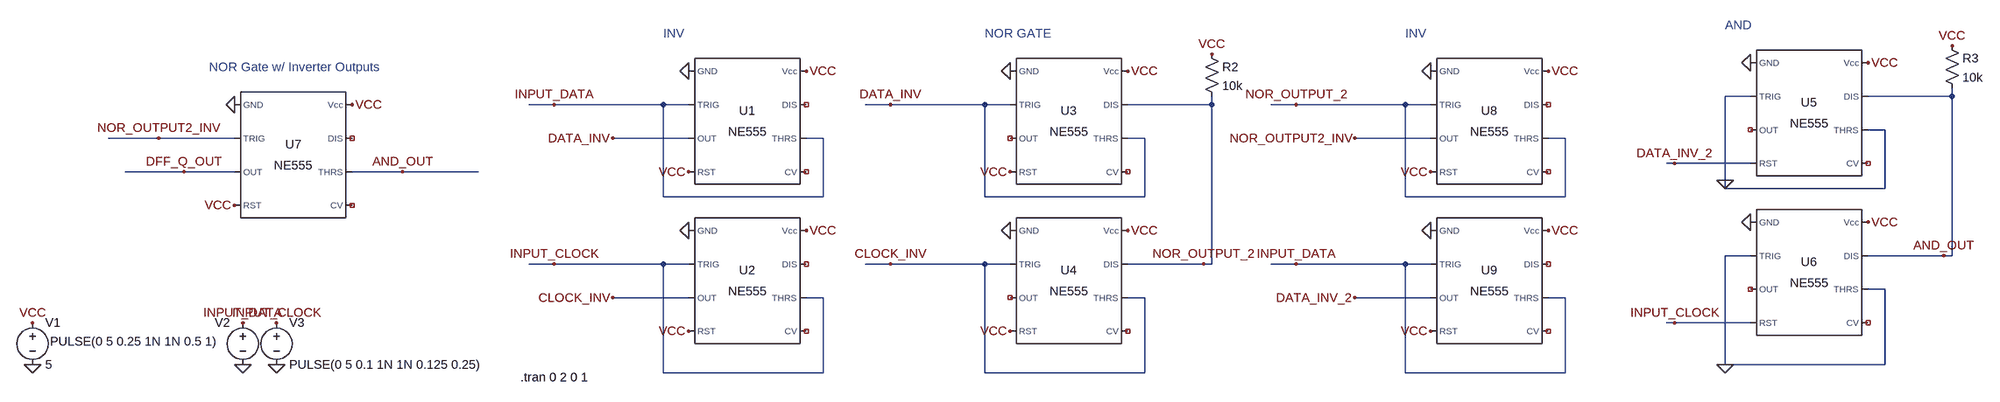
[diagram p0: schematic 555_D_Flip_Flop.asc]
555_D_Flip_Flop.asc, the LTspice schematic file:
Version 4
SHEET 1 2580 680
WIRE 2112 32 2064 32
WIRE 2496 32 2496 16
WIRE 2496 32 2336 32
WIRE -224 48 -272 48
WIRE -16 48 -224 48
WIRE 32 48 -16 48
WIRE 416 48 368 48
WIRE 624 48 416 48
WIRE 672 48 624 48
WIRE 1056 48 1056 32
WIRE 1056 48 896 48
WIRE 1216 48 1168 48
WIRE 1424 48 1216 48
WIRE 1472 48 1424 48
WIRE 2368 96 2336 96
WIRE -976 112 -1072 112
WIRE -832 112 -976 112
WIRE 32 112 -112 112
WIRE 288 112 256 112
WIRE 928 112 896 112
WIRE 1472 112 1328 112
WIRE 1728 112 1696 112
WIRE 1968 160 1952 160
WIRE 2112 160 1968 160
WIRE -928 176 -1040 176
WIRE -832 176 -928 176
WIRE -512 176 -608 176
WIRE -368 176 -512 176
WIRE 2064 192 2064 32
WIRE 2064 208 2064 192
WIRE 2368 208 2368 96
WIRE 2368 208 2064 208
WIRE -16 224 -16 48
WIRE 288 224 288 112
WIRE 288 224 -16 224
WIRE 624 224 624 48
WIRE 928 224 928 112
WIRE 928 224 624 224
WIRE 1424 224 1424 48
WIRE 1728 224 1728 112
WIRE 1728 224 1424 224
WIRE 2112 336 2064 336
WIRE 2480 336 2336 336
WIRE 2496 336 2496 32
WIRE 2496 336 2480 336
WIRE -224 352 -272 352
WIRE -16 352 -224 352
WIRE 32 352 -16 352
WIRE 416 352 368 352
WIRE 624 352 416 352
WIRE 672 352 624 352
WIRE 1040 352 896 352
WIRE 1056 352 1056 48
WIRE 1056 352 1040 352
WIRE 1216 352 1168 352
WIRE 1424 352 1216 352
WIRE 1472 352 1424 352
WIRE 2368 400 2336 400
WIRE 32 416 -112 416
WIRE 288 416 256 416
WIRE 928 416 896 416
WIRE 1472 416 1328 416
WIRE 1728 416 1696 416
WIRE 1968 464 1952 464
WIRE 2112 464 1968 464
WIRE 2064 544 2064 336
WIRE 2368 544 2368 400
WIRE 2368 544 2064 544
WIRE -16 560 -16 352
WIRE 288 560 288 416
WIRE 288 560 -16 560
WIRE 624 560 624 352
WIRE 928 560 928 416
WIRE 928 560 624 560
WIRE 1424 560 1424 352
WIRE 1728 560 1728 416
WIRE 1728 560 1424 560
FLAG -1216 544 0
FLAG -1216 464 VCC
FLAG 32 -16 0
FLAG 256 -16 VCC
FLAG 32 288 0
FLAG 256 288 VCC
FLAG -112 112 DATA_INV
FLAG -112 416 CLOCK_INV
FLAG -224 48 INPUT_DATA
FLAG -224 352 INPUT_CLOCK
FLAG -816 544 0
FLAG -816 464 INPUT_DATA
FLAG -752 544 0
FLAG -752 464 INPUT_CLOCK
FLAG 32 176 VCC
FLAG 32 480 VCC
FLAG 672 -16 0
FLAG 896 -16 VCC
FLAG 672 288 0
FLAG 896 288 VCC
FLAG 416 48 DATA_INV
FLAG 416 352 CLOCK_INV
FLAG 1056 -48 VCC
FLAG 1040 352 NOR_OUTPUT_2
FLAG 672 176 VCC
FLAG 672 480 VCC
FLAG 2112 -32 0
FLAG 2336 -32 VCC
FLAG 2112 272 0
FLAG 2336 272 VCC
FLAG 2496 -64 VCC
FLAG 2480 336 AND_OUT
FLAG -832 48 0
FLAG -608 48 VCC
FLAG -832 240 VCC
FLAG 1472 -16 0
FLAG 1696 -16 VCC
FLAG 1472 288 0
FLAG 1696 288 VCC
FLAG 1328 112 NOR_OUTPUT2_INV
FLAG 1328 416 DATA_INV_2
FLAG 1216 48 NOR_OUTPUT_2
FLAG 1216 352 INPUT_DATA
FLAG 1472 176 VCC
FLAG 1472 480 VCC
FLAG 2064 192 0
FLAG 2064 544 0
FLAG 1968 464 INPUT_CLOCK
FLAG 1968 160 DATA_INV_2
FLAG -512 176 AND_OUT
FLAG -976 112 NOR_OUTPUT2_INV
FLAG -928 176 DFF_Q_OUT
SYMBOL voltage -1216 448 R0
SYMATTR InstName V1
SYMATTR Value 5
SYMBOL Misc\\NE555 144 80 R0
SYMATTR InstName U1
SYMBOL Misc\\NE555 144 384 R0
SYMATTR InstName U2
SYMBOL voltage -816 448 M0
WINDOW 3 49 52 Left 2
WINDOW 123 0 0 Left 0
WINDOW 39 0 0 Left 0
SYMATTR Value PULSE(0 5 0.25 1N 1N 0.5 1)
SYMATTR InstName V2
SYMBOL voltage -752 448 R0
WINDOW 123 0 0 Left 0
WINDOW 39 0 0 Left 0
SYMATTR InstName V3
SYMATTR Value PULSE(0 5 0.1 1N 1N 0.125 0.25)
SYMBOL Misc\\NE555 784 80 R0
SYMATTR InstName U3
SYMBOL Misc\\NE555 784 384 R0
SYMATTR InstName U4
SYMBOL res 1040 -64 R0
SYMATTR InstName R2
SYMATTR Value 10k
SYMBOL Misc\\NE555 2224 64 R0
SYMATTR InstName U5
SYMBOL Misc\\NE555 2224 368 R0
SYMATTR InstName U6
SYMBOL res 2480 -80 R0
SYMATTR InstName R3
SYMATTR Value 10k
SYMBOL Misc\\NE555 -720 144 R0
SYMATTR InstName U7
SYMBOL Misc\\NE555 1584 80 R0
SYMATTR InstName U8
SYMBOL Misc\\NE555 1584 384 R0
SYMATTR InstName U9
TEXT -16 -88 Left 2 ;INV
TEXT -288 568 Left 2 !.tran 0 2 0 1
TEXT 624 -88 Left 2 ;NOR GATE
TEXT 2064 -104 Left 2 ;AND
TEXT -880 -24 Left 2 ;NOR Gate w/ Inverter Outputs
TEXT 1424 -88 Left 2 ;INV

The netlist it stands for:
* 555_D_Flip_Flop.asc
V1 VCC 0 5
XU1 0 INPUT_DATA DATA_INV VCC NC_01 INPUT_DATA NC_02 VCC NE555  ; pins GND TRIG OUT RST CV THRS DIS Vcc
XU2 0 INPUT_CLOCK CLOCK_INV VCC NC_03 INPUT_CLOCK NC_04 VCC NE555  ; pins GND TRIG OUT RST CV THRS DIS Vcc
V2 INPUT_DATA 0 PULSE(0 5 0.25 1N 1N 0.5 1)
V3 INPUT_CLOCK 0 PULSE(0 5 0.1 1N 1N 0.125 0.25)
XU3 0 DATA_INV NC_05 VCC NC_06 DATA_INV NOR_OUTPUT_2 VCC NE555  ; pins GND TRIG OUT RST CV THRS DIS Vcc
XU4 0 CLOCK_INV NC_07 VCC NC_08 CLOCK_INV NOR_OUTPUT_2 VCC NE555  ; pins GND TRIG OUT RST CV THRS DIS Vcc
R2 VCC NOR_OUTPUT_2 10k
XU5 0 0 NC_09 DATA_INV_2 NC_10 0 AND_OUT VCC NE555  ; pins GND TRIG OUT RST CV THRS DIS Vcc
XU6 0 0 NC_11 INPUT_CLOCK NC_12 0 AND_OUT VCC NE555  ; pins GND TRIG OUT RST CV THRS DIS Vcc
R3 VCC AND_OUT 10k
XU7 0 NOR_OUTPUT2_INV DFF_Q_OUT VCC NC_13 AND_OUT NC_14 VCC NE555  ; pins GND TRIG OUT RST CV THRS DIS Vcc
XU8 0 NOR_OUTPUT_2 NOR_OUTPUT2_INV VCC NC_15 NOR_OUTPUT_2 NC_16 VCC NE555  ; pins GND TRIG OUT RST CV THRS DIS Vcc
XU9 0 INPUT_DATA DATA_INV_2 VCC NC_17 INPUT_DATA NC_18 VCC NE555  ; pins GND TRIG OUT RST CV THRS DIS Vcc
* INV
.tran 0 2 0 1
* NOR GATE
* AND
* NOR Gate w/ Inverter Outputs
* INV
.lib NE555.sub
.backanno
.end

* Results of the author's LTspice run, read from the files saved beside the schematic
* Operating Point, zero values left out:
*   V(vcc) = 5 V
*   V(data_inv) = 5 V
*   V(clock_inv) = 5 V
*   V(nor_output_2) = 5 V
*   V(and_out) = 2.998 mV
*   V(data_inv_2) = 5 V
*   V(nor_output2_inv) = 5 V
*   V(dff_q_out) = 5 V
*   I(R3) = 499.7 µA
*   I(R2) = 23.34 nA
*   I(V3) = 400 µA
*   I(V1) = -15.38 mA
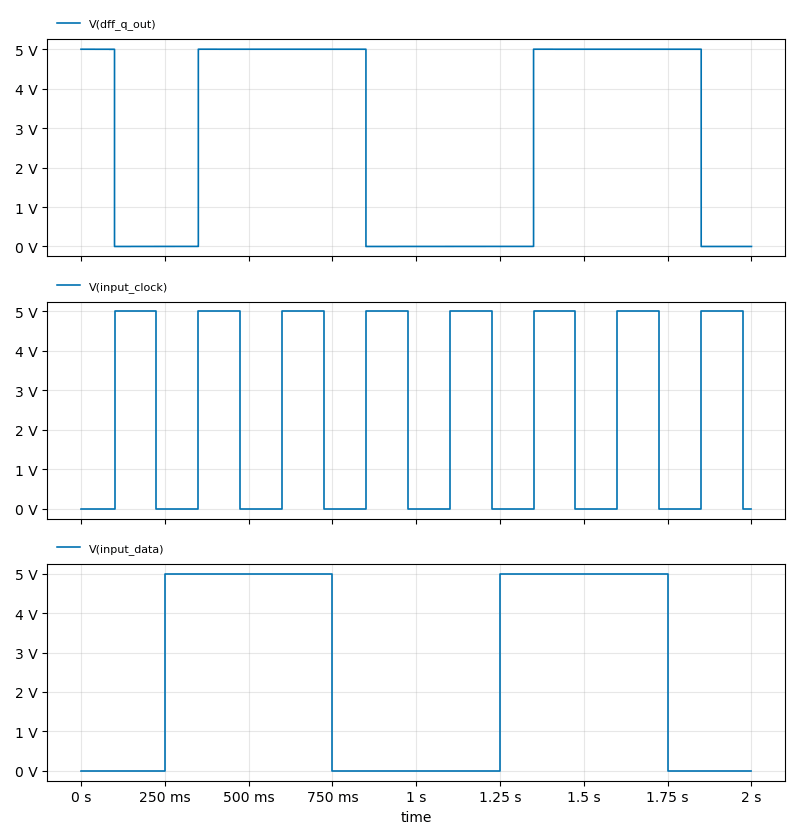
[diagram p1: Transient Analysis of 555_D_Flip_Flop.asc, plotted from the saved traces]
* Transient Analysis, 1 run:
*   V(dff_q_out): min 30 µV, max 5 V, average 2.75 V, rms 3.708 V, last 30 µV
*   V(input_clock): min 0 V, max 5 V, average 2.5 V, rms 3.536 V, last 0 V
*   V(input_data): min 0 V, max 5 V, average 2.5 V, rms 3.536 V, last 0 V